# Altium project BMS Design 3.PrjPcb
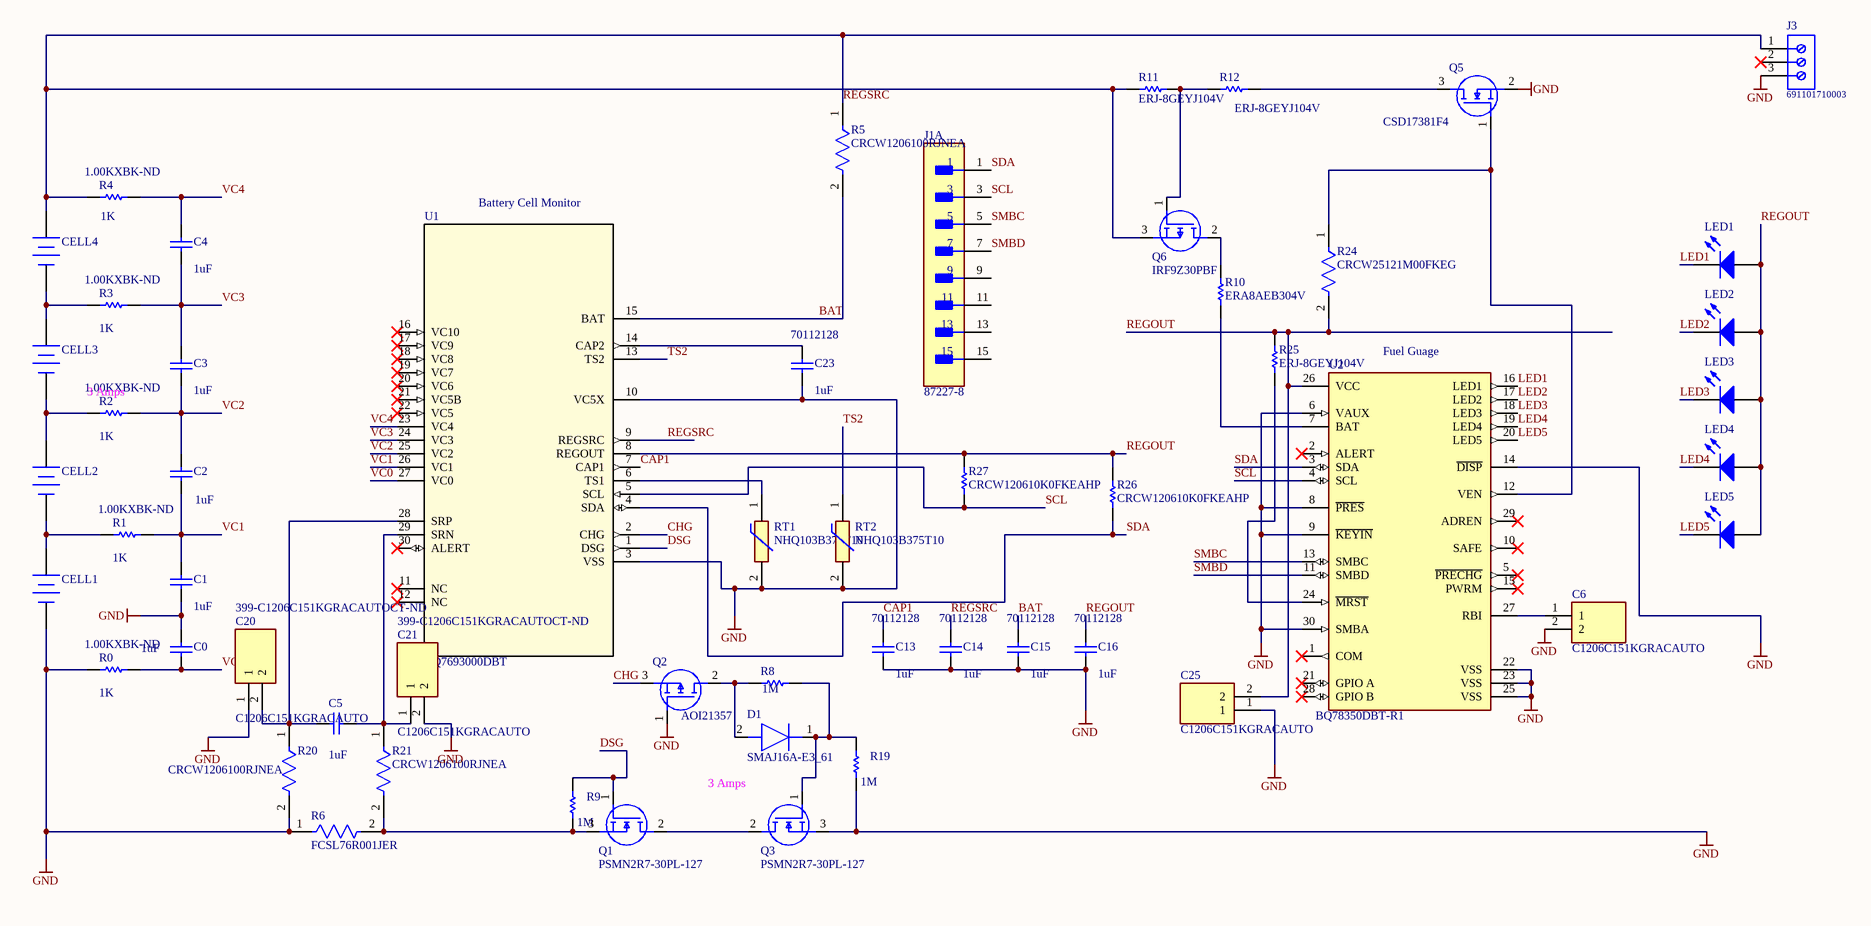
[diagram p0: BMS Design 3 New Part Monitor.SchDoc]
1 sheet, 55 parts. Net scope: global (net labels, ports and power ports of the same name join across sheets).
Board file: BMS pcb layout 3.PcbDoc

## Sheet BMS Design 3 New Part Monitor.SchDoc
size C; SheetNumber: 1; SheetTotal: 1; SPICEModelCacheHQQCTOEM: <root> / <DocumentId>HQQCTOEM</DocumentId> / <CacheFrame Number="0"> / <Model Name="cap" Kind="MDL"> / <Text>*Default semiconductor capacitor / .MODEL CAP C()</Text> / </Model> / </CacheFrame> / </root>

### Parts
C0  value 1uF  [RAD-0.3]
C1  value 1uF  [RAD-0.3]
C2  value 1uF  [RAD-0.3]
C3  value 1uF  [RAD-0.3]
C4  value 1uF  [RAD-0.3]
C5  value 1uF  [RAD-0.3]
C6  C1206C151KGRACAUTO  [CAPC3216X180N]
C13  value 1uF  Supplier Part Number 1: 70112128  [RAD-0.3]
C14  value 1uF  Supplier Part Number 1: 70112128  [RAD-0.3]
C15  value 1uF  Supplier Part Number 1: 70112128  [RAD-0.3]
C16  value 1uF  Supplier Part Number 1: 70112128  [RAD-0.3]
C20  C1206C151KGRACAUTO  Supplier Part Number 1: 399-C1206C151KGRACAUTOCT-ND  [CAPC3216X180N]
C21  C1206C151KGRACAUTO  Supplier Part Number 1: 399-C1206C151KGRACAUTOCT-ND  [CAPC3216X180N]
C23  value 1uF  Supplier Part Number 1: 70112128  [RAD-0.3]
C25  C1206C151KGRACAUTO  [CAPC3216X180N]
CELL1  (no value)  [BAT-2]
CELL2  (no value)  [BAT-2]
CELL3  (no value)  [BAT-2]
CELL4  (no value)  [BAT-2]
D1  SMAJ16A-E3_61  [DIOM5127X229N]
J1  87227-8  [FP-87227-8-MFG]  (part A of 2)
J3  691101710003  [691101710003]
LED1  (no value)  [LED-0]
LED2  (no value)  [LED-0]
LED3  (no value)  [LED-0]
LED4  (no value)  [LED-0]
LED5  (no value)  [LED-0]
Q1  PSMN2R7-30PL-127  [TO-220AB]
Q2  AOI21357  [TO229P239X654X854-3P]
Q3  PSMN2R7-30PL-127  [TO-220AB]
Q5  CSD17381F4  [CSD17381F4]
Q6  IRF9Z30PBF  [TO254P465X1024X2050-3P]
R0  value 1K  Supplier Part Number 1: 1.00KXBK-ND  [AXIAL-0.3]
R1  value 1K  Supplier Part Number 1: 1.00KXBK-ND  [AXIAL-0.3]
R2  value 1K  Supplier Part Number 1: 1.00KXBK-ND  [AXIAL-0.3]
R3  value 1K  Supplier Part Number 1: 1.00KXBK-ND  [AXIAL-0.3]
R4  value 1K  Supplier Part Number 1: 1.00KXBK-ND  [AXIAL-0.3]
R5  CRCW1206100RJNEA  [FP-CRCW1206-e3-IPC_B]
R6  FCSL76R001JER  [FP-FCSL76-0R001-MFG]
R8  value 1M  [AXIAL-0.3]
R9  value 1M  [AXIAL-0.3]
R10  ERA8AEB304V  [RESC3216X70X50LL20T25]
R11  ERJ-8GEYJ104V  [RESC3216X70X50LL05T20]
R12  ERJ-8GEYJ104V  [RESC3216X70X50LL05T20]
R19  value 1M  [AXIAL-0.3]
R20  CRCW1206100RJNEA  [FP-CRCW1206-e3-IPC_B]
R21  CRCW1206100RJNEA  [FP-CRCW1206-e3-IPC_B]
R24  CRCW25121M00FKEG  [FP-CRCW2512-e3-IPC_C]
R25  ERJ-8GEYJ104V  [RESC3216X70X50LL05T20]
R26  CRCW120610K0FKEAHP  [RESC3116X65X50NL20T20]
R27  CRCW120610K0FKEAHP  [RESC3116X65X50NL20T20]
RT1  NHQ103B375T10  [RESC2113X66N]
RT2  NHQ103B375T10  [RESC2113X66N]
U1  BQ7693000DBT  [DBT0030A_N]
U2  BQ78350DBT-R1  [FP-DBT0030A-IPC_C]

### Nets
GND: C0.2 C1.1 C6.2 C13.1 C14.1 C15.1 C16.1 C20.1 C21.2 C23.1 C25.1 CELL1.2(-) J3.3 Q2.1(G) Q3.3(S) Q5.2(S) R0.1 R6.1 R19.1 R20.2 RT1.2 RT2.2 U1.3(VSS) U1.10(VC5X) U2.6(VAUX) U2.8(~{PRES}) U2.9(~{KEYIN}) U2.14(~{DISP}) U2.22(VSS) U2.23(VSS) U2.25(VSS) U2.30(SMBA)
BAT: C15.2 R5.2 U1.15(BAT)
CAP1: C13.2 U1.7(CAP1)
CHG: Q2.3(S) U1.2(CHG)
DSG: Q1.1(G) R9.2 U1.1(DSG)
LED1: LED1.2(K) U2.16(LED1)
LED2: LED2.2(K) U2.17(LED2)
LED3: LED3.2(K) U2.18(LED3)
LED4: LED4.2(K) U2.19(LED4)
LED5: LED5.2(K) U2.20(LED5)
REGOUT: C16.2 C25.2 LED1.1(A) LED2.1(A) LED3.1(A) LED4.1(A) LED5.1(A) R24.2 R25.2 R26.2 R27.2 U1.8(REGOUT) U2.26(VCC)
REGSRC: C14.2 CELL4.1(+) J3.1 Q6.3(S) R4.1 R5.1 R11.1 U1.9(REGSRC)
SCL: J1.3 R27.1 U1.5(SCL) U2.4(SCL)
SDA: J1.1 R26.1 U1.4(SDA) U2.3(SDA)
SMBC: J1.5 U2.13(SMBC)
SMBD: J1.7 U2.11(SMBD)
TS2: RT2.1 U1.13(TS2)
VC0: C0.1 R0.2 U1.27(VC0)
VC1: C1.2 C2.1 R1.2 U1.26(VC1)
VC2: C2.2 C3.1 R2.2 U1.25(VC2)
VC3: C3.2 C4.1 R3.2 U1.24(VC3)
VC4: C4.2 R4.2 U1.23(VC4)
NetC5_1: C5.1 C20.2 R20.1 U1.28(SRP)
NetC5_2: C5.2 C21.1 R21.1 U1.29(SRN)
NetC6_1: C6.1 U2.27(RBI)
NetC23_2: C23.2 U1.14(CAP2)
NetCELL1_1: CELL1.1(+) CELL2.2(-) R1.1
NetCELL2_1: CELL2.1(+) CELL3.2(-) R2.1
NetCELL3_1: CELL3.1(+) CELL4.2(-) R3.1
NetD1_1: D1.1(K) Q3.1(G) R8.1 R19.2
NetD1_2: D1.2(A) Q2.2(D) R8.2
NetQ1_2: Q1.2(D) Q3.2(D)
NetQ1_3: Q1.3(S) R6.2 R9.1 R21.2
NetQ5_1: Q5.1(G) R24.1 U2.12(VEN)
NetQ5_3: Q5.3(D) R12.2
NetQ6_1: Q6.1(G) R11.2 R12.1
NetQ6_2: Q6.2(D) R10.2
NetR10_1: R10.1 U2.7(BAT)
NetR25_1: R25.1 U2.24(~{MRST})
NetRT1_1: RT1.1 U1.6(TS1)

Not connected (* = marked no-connect by the designer): J1 9 11 13 15; J3 2*; U1 11(NC)* 12(NC)* 16(VC10)* 17(VC9)* 18(VC8)* 19(VC7)* 20(VC6)* 21(VC5B)* 22(VC5)* 30(ALERT)*; U2 1(COM)* 2(ALERT)* 5(~{PRECHG})* 10(SAFE)* 15(PWRM)* 21(GPIO_A)* 28(GPIO_B)* 29(ADREN)*

### Notes on the sheet
- Battery Cell Monitor
- (near U2) Fuel Guage
- (near R2) 3 Amps
- (near Q3) 3 Amps

### Library data of the parts
C0-C5 C13-C16 C23 = Cap: Capacitor; Published: 8-Jun-2000; LatestRevisionDate: 17-Jul-2002; LatestRevisionNote: Re-released for DXP Platform.; PackageReference: RAD-0.3; Publisher: Altium Limited; PackageDescription: Radial Cap, Thru-Hole; 2 Leads; 0.3 in Pin Spacing
  C13-C16 C23: Supplier 1: Allied Electronics
C6 C20 C21 C25 = C1206C151KGRACAUTO: Capacitor Network; Manufacturer_Name: KEMET; Datasheet Link: https://content.kemet.com/datasheets/KEM_C1076_X7R_HV_AUTO_SMD.pdf; Height: 1.8mm; Manufacturer_Part_Number: C1206C151KGRACAUTO; Supplier 1: Digi-Key
CELL1-CELL4 = Battery: Multicell Battery; Published: 24-Mar-1999; LatestRevisionDate: 17-Jul-2002; LatestRevisionNote: Re-released for DXP Platform.; PackageReference: BAT-2; Publisher: Altium Limited; PackageDescription: Battery; 2 Leads
D1 = SMAJ16A-E3_61: Diode; Manufacturer_Name: Vishay; Manufacturer_Part_Number: SMAJ16A-E3/61; Datasheet Link: https://datasheet.datasheetarchive.com/originals/distributors/Datasheets-DGA26/1844793.pdf; Height: 2.29mm; Mouser Part Number: 625-SMAJ16A-E3; Mouser Price/Stock: https://www.mouser.co.uk/ProductDetail/Vishay-General-Semiconductor/SMAJ16A-E3-61?qs=nE2yEqgPWzeXpRX%2FtbmQvg%3D%3D; Arrow Part Number: SMAJ16A-E3/61; Arrow Price/Stock: https://www.arrow.com/en/products/smaj16a-e361/vishay?region=nac
J1 = CMP-03369-000064-1: CONN HEADER VERT 16POS 2.54MM; Manufacturer: TE Connectivity; Conn Gender: Male; Conn Orientation: Straight; Current Rating: 3A; Number Of Contacts: 16; Mouser Description: Headers & Wire Housings UNSHRD VERT DUAL 16; Lead Free: Yes; Digikey Description: CONN HEADER VERT 16POS 2.54MM; Device Class L3: unset; Automotive: No; Height: 0.428inch; Temperature Range Low: -65°C; Device Class L1: Connectors; RoHS: TRUE; Pitch: 2.54mm; Package: 0; Manufacturer Part Number: 87227-8; Number Of Rows: 2; Footprint Url: https://www.te.com/commerce/DocumentDelivery/DDEController?Action=showdoc&DocId=Customer+Drawing%7F87227%7FH4%7Fpdf%7FEnglish%7FENG_CD_87227_H4.pdf%7F87227-8; ComponentLink2URL: https://www.te.com/usa-en/product-87227-8.datasheet.pdf; ComponentLink2Description: Datasheet; Temperature: -65°C to +105°C; Category: Conn; Temperature Range High: +105°C; Octopart: https://octopart.com/87227-8-te+connectivity-39407754; Device Class L2: Headers and Wire Housings; Contact Material: Gold,Nickel
J3 = CMP-1502-03257-1: Series 101 - 5.00 mm Horizontal Entry Modular with Pressure Clamp WR-TBL, 3 pin; Manufacturer: Wurth Elektronik; Pitch: 5.00mm; Pin Number: 3; Publisher: WurthElektronik; Part Number: 691101710003; Operating Temperature: -40to105degC; Package Reference: 691101710003; Packaging: Box; Manufacturer URL: http://www.we-online.de; Datasheet URL: http://katalog.we-online.de/em/datasheet/6911017100xx.pdf; Mounting Technology: THT
LED1-LED5 = LED0: Typical INFRARED GaAs LED; Published: 8-Jun-2000; LatestRevisionDate: 08-Jul-2005; LatestRevisionNote: Mech Layer 1 removed.; PackageReference: LED-0; Publisher: Altium Limited; PackageDescription: LED; 2 Leads
Q1 Q3 = PSMN2R7-30PL,127: MOSFET (N-Channel); Manufacturer_Name: Nexperia; Datasheet Link: https://assets.nexperia.com/documents/data-sheet/PSMN2R7-30PL.pdf; Height: 4.7mm; Manufacturer_Part_Number: PSMN2R7-30PL,127; Mouser Part Number: 771-PSMN2R730PL127; Mouser Price/Stock: https://www.mouser.com/Search/Refine.aspx?Keyword=771-PSMN2R730PL127; Arrow Part Number: PSMN2R7-30PL,127; Arrow Price/Stock: https://www.arrow.com/en/products/psmn2r7-30pl127/nexperia
Q2 = AOI21357: MOSFET (P-Channel); Manufacturer_Name: Alpha & Omega Semiconductors; Datasheet Link: http://www.aosmd.com/res/data_sheets/AOI21357.pdf; Height: 2.39mm; Manufacturer_Part_Number: AOI21357; ComponentLink1Description: New link; ComponentLink1URL: *
Q5 = CSD17381F4: MOSFET (N-Channel); Manufacturer_Name: Texas Instruments; Datasheet Link: https://www.ti.com/lit/gpn/csd17381f4?HQS=ti-null-null-sf-df-pf-sep-wwe&DCM=yes?hkey=EF798316E3902B6ED9A73243A3159BB0; Height: 0.36mm; Manufacturer_Part_Number: CSD17381F4
Q6 = IRF9Z30PBF: MOSFET (P-Channel); Manufacturer_Name: Vishay; Datasheet Link: https://www.vishay.com/docs/91459/sihf9z30.pdf; Height: 4.65mm; Manufacturer_Part_Number: IRF9Z30PBF; Mouser Part Number: 844-IRF9Z30PBF; Mouser Price/Stock: https://www.mouser.co.uk/ProductDetail/Vishay-Semiconductors/IRF9Z30PBF?qs=cvaI6ThkwxutsTwPQAypYg%3D%3D; Arrow Part Number: IRF9Z30PBF; Arrow Price/Stock: https://www.arrow.com/en/products/irf9z30pbf/vishay?region=nac
R0-R4 R8 R9 R19 = Res1: Resistor; Published: 8-Jun-2000; LatestRevisionDate: 17-Jul-2002; LatestRevisionNote: Re-released for DXP Platform.; PackageReference: AXIAL-0.3; Publisher: Altium Limited; PackageDescription: Axial Device, Thru-Hole; 2 Leads; 0.3 in Pin Spacing
  R0-R4: Supplier 1: Digi-Key
R5 R20 R21 = CMP-2003-04802-2: RES Thick Film, 100Ω, 5%, 0.25W, 200ppm/°C, 1206; Power Rating: 250mW; Voltage Rating: 200V; Resistance: 100R; Min Operating Temperature: -55°C; Termination: SMD/SMT; Packaging: Tape and Reel; Contact Plating: Tin; Military Standard: Not; Temperature Coefficient: 200ppm/°C; Tolerance: 5%; Depth: 1.6mm; Weight: 0.000353oz; Mount: Surface Mount; Max Operating Temperature: 155°C; Width: 1.6mm; Length: 3.2mm; Height: 0.55mm; Case Code (Imperial): 1206; Radiation Hardening: No; Composition: Thick Film; Case Code (Metric): 3216; Package Quantity: 5000; Case/Package: 1206
R6 = CMP-33361-000036-1: RES 0.001 OHM 3W 3015 WIDE; Resistance: 1mR; Resistance Tolerance: 5%; Temperature Coefficient: 150ppm/°C; Series: FCSL; Case Code (Metric): 7638; Max Power Dissipation: 3W; Min Operating Temperature: -55°C; Depth: 3.8mm; Number of Terminations: 2; Case Code (Imperial): 3015; RoHS Compliant: Yes; Length: 0.15inch; Technology: METAL FOIL; Tolerance: 5%; Case/Package: 7638; Number of Pins: 2; Mount: Surface Mount; Width: 7.6mm; Power Rating: 3W; Max Operating Temperature: 155°C; Termination: SMD/SMT; Packaging: Tape and Reel; Features: Moisture Resistant; Height - Seated (Max): 0.028inch; Resistor Type: Metal Foil; Package Quantity: 1000; Height: 1.35mm
R10 = CMP-2003-04453-1: Manufacturer: Panasonic; Part Number: ERA8AEB304V
R11 R12 R25 = CMP-2003-00546-1: Manufacturer: Panasonic; Part Number: ERJ-8GEYJ104V
R24 = CMP-02407-005447-1: RES Thick Film, 1MΩ, 1%, 1W, 100ppm/°C, 2512; Voltage Rating: 500V; Resistance: 1MR; Height: 0.6mm; Number of Pins: 2; Min Operating Temperature: -55°C; Weight: 0.001429oz; Contact Plating: Tin; Power Rating: 1W; Max Power Dissipation: 1W; Temperature Coefficient: 100ppm/°C; Radiation Hardening: No; REACH SVHC: No SVHC; Tolerance: 1%; Termination: SMD/SMT; Lead Free: Lead Free; Package Quantity: 10; Voltage Rating (DC): 500V; Case Code (Imperial): 2512; Packaging: Tape and Reel; Military Standard: Not; Width: 3.15mm; Case/Package: 2512; Case Code (Metric): 6432; Length: 6.3mm; Max Operating Temperature: 155°C; Number of Terminations: 2; Depth: 3.15mm; Composition: Thick Film; Features: Automotive AEC-Q200
R26 R27 = CMP-2003-04883-1: Manufacturer: Vishay Dale; Part Number: CRCW120610K0FKEAHP
RT1 RT2 = NHQ103B375T10: Thermistor; Manufacturer_Name: Amphenol; Datasheet Link: https://ad.componentsearchengine.com/Datasheets/2/NHQ103B375T10.pdf; Height: 0.66mm; Manufacturer_Part_Number: NHQ103B375T10
U1 = BQ7693000DBT: No Description Available; Mfr_Name: Texas Instruments; Type: DEV; RefDes: RefDes; Copyright: Copyright (C) 2022 Ultra Librarian. All rights reserved.; Manufacturer_Part_Number: BQ7693000DBT
U2 = CMP-04911-000039-1: IC BATTERY MGMT CTRLR 30TSSOP; Max Supply Voltage: 2.6V; Fault Protection: Over Current; Min Supply Voltage: 2.4V; Interface: SMBus; Output Voltage: 5.5V; Mount: Surface Mount; Min Operating Temperature: -40°C; Number of Pins: 30; Contact Plating: Gold; REACH SVHC: No SVHC; Lead Free: Lead Free; Case/Package: TSSOP; Max Operating Temperature: 85°C; Packaging: Rail/Tube; RoHS Compliant: Yes; Parameter 1: *